# EAGLE design sender (EAGLE 6.5.0)
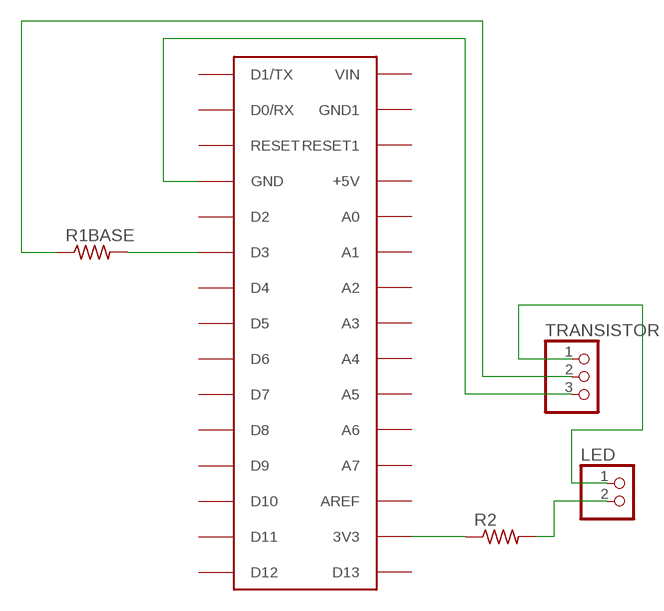
[diagram p0: schematic, sheet 1]

## Parts
LED  PINHD-1X2  [1X02]
R1BASE  R-US_0207/12  [0207/12]
R2  R-US_0207/12  [0207/12]
TRANSISTOR  PINHD-1X3  [1X03]
U$1  ARDUINONANO  [PDIP-32]

## Nets
N$1: TRANSISTOR.3 U$1.GND
N$2: LED.1 TRANSISTOR.1
N$3: LED.2 R2.2
N$4: R2.1 U$1.3V3
N$5: R1BASE.1 TRANSISTOR.2
N$6: R1BASE.2 U$1.D3
Unconnected: U$1.+5V U$1.A0 U$1.A1 U$1.A2 U$1.A3 U$1.A4 U$1.A5 U$1.A6 U$1.A7 U$1.AREF U$1.D0/RX U$1.D1/TX U$1.D2 U$1.D4 U$1.D5 U$1.D6 U$1.D7 U$1.D8 U$1.D9 U$1.D10 U$1.D11 U$1.D12 U$1.D13 U$1.GND1 U$1.RESET U$1.RESET1 U$1.VIN

## Library data of the parts
LED = pinhead:PINHD-1X2: PIN HEADER
R1BASE R2 = rcl:R-US_: RESISTOR, American symbol
TRANSISTOR = pinhead:PINHD-1X3: PIN HEADER
U$1 = jet-lib:ARDUINONANO

## Board
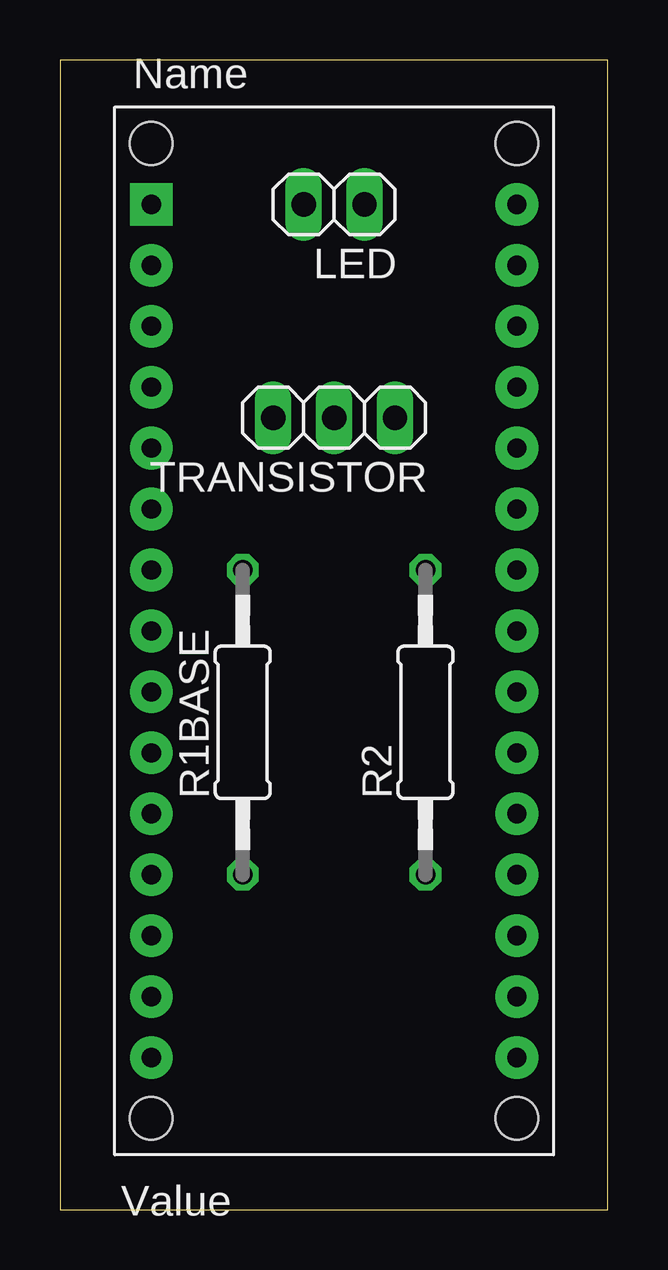
[diagram p1: board, top side]
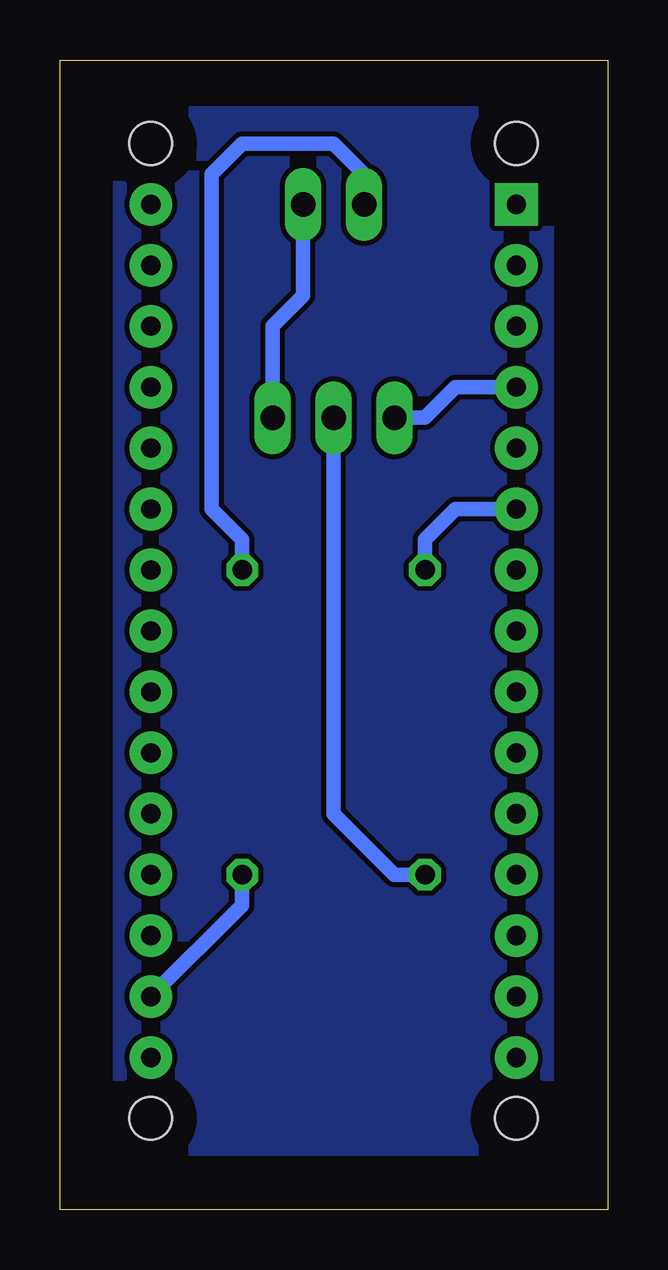
[diagram p2: board, bottom side, seen from below]

Size 22.84 x 47.93 mm. Coordinates in mm from the lower left corner, seen from the top.
Outline: 0,0 22.84,0 22.84,47.93 0,47.93 0,0
Copper layers (1*16): Top 0.035mm / dielectric 1.5mm / Bottom 0.035mm
Design rules "default": minimum track width 10mil, minimum drill 24mil, track to track 8mil, track to pad 8mil, pad to pad 8mil, via to via 8mil, smd to smd 8mil, copper to edge 40mil, drill to drill 8mil, minimum pad ring 10mil, minimum via ring 8mil, stop-mask expansion 4mil, vias tented up to drill 0mil, thermal gap 10mil

### Footprints (pad centres in the part's own frame; a part is rotated, then mirrored left to right if it is on the bottom)
1X02 = drill 1.016 long: 1 -1.27,0; 2 1.27,0
0207/12 = drill 0.813 octagon: 1 -6.35,0; 2 6.35,0
1X03 = drill 1.016 long: 1 -2.54,0; 2 0,0; 3 2.54,0
PDIP-32 = drill 0.8 pad 1.778: 3V3 15.24,-35.56; +5V 15.24,-10.16; A0 15.24,-12.7; A1 15.24,-15.24; A2 15.24,-17.78; A3 15.24,-20.32; A4 15.24,-22.86; A5 15.24,-25.4; A6 15.24,-27.94; A7 15.24,-30.48; AREF 15.24,-33.02; D0/RX 0,-5.08; D2 0,-12.7; D3 0,-15.24; D4 0,-17.78; D5 0,-20.32; D6 0,-22.86; D7 0,-25.4; D8 0,-27.94; D9 0,-30.48; D10 0,-33.02; D11 0,-35.56; D12 0,-38.1; D13 15.24,-38.1; GND 0,-10.16; GND1 15.24,-5.08; RESET 0,-7.62; RESET1 15.24,-7.62; VIN 15.24,-2.54 | drill 0.8 pad 1.778 square: D1/TX 0,-2.54 | hole 1.778: 0,0; 0,-40.64; 15.24,-40.64; 15.24,0

### Placement (x,y rotation side)
LED  11.43,41.91 180 top
R1BASE  7.62,20.32 90 top
R2  15.24,20.32 90 top
TRANSISTOR  11.43,33.02 180 top
U$1  3.81,44.45 0 top

### Tracks (layer width: path | path; a pad name or v marks a point on that pad's centre or on a via)
N$1
  Bottom 0.61: TRANSISTOR.3 7.62,33.02 6.35,34.29 U$1.GND
N$2
  Bottom 0.61: TRANSISTOR.1 13.97,36.83 12.7,38.1 LED.1
N$3
  Bottom 0.61: R2.2 15.24,27.94 16.51,29.21 16.51,43.18 15.24,44.45 11.43,44.45 10.16,43.18 LED.2
N$4
  Bottom 0.61: R2.1 15.24,12.7 U$1.3V3
N$5
  Bottom 0.61: R1BASE.1 8.89,13.97 11.43,16.51 TRANSISTOR.2
N$6
  Bottom 0.61: R1BASE.2 7.62,27.94 6.35,29.21 U$1.D3
N$7
  pour Bottom: 2.54,45.72 20.32,45.72 20.32,40.64 20.32,2.54 2.54,2.54